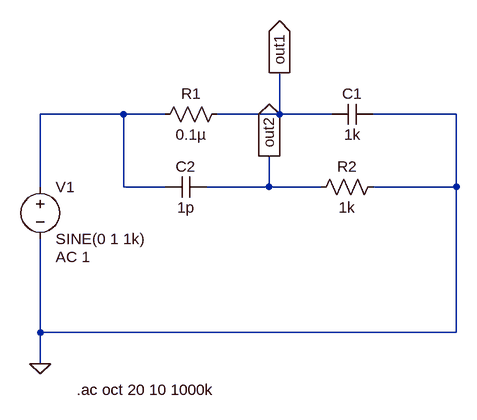
[diagram p0: schematic c-analysis.asc]
c-analysis.asc, the LTspice schematic file:
Version 4.1
SHEET 1 880 680
WIRE -224 80 -352 80
WIRE -160 80 -224 80
WIRE 16 80 16 16
WIRE 16 80 -80 80
WIRE 96 80 16 80
WIRE 288 80 160 80
WIRE -352 192 -352 80
WIRE -224 192 -224 80
WIRE -160 192 -224 192
WIRE 0 192 0 144
WIRE 0 192 -96 192
WIRE 80 192 0 192
WIRE 288 192 288 80
WIRE 288 192 160 192
WIRE -352 416 -352 272
WIRE 288 416 288 192
WIRE 288 416 -352 416
WIRE -352 464 -352 416
FLAG -352 464 0
FLAG 16 16 out1
IOPIN 16 16 Out
FLAG 0 144 out2
IOPIN 0 144 Out
SYMBOL voltage -352 176 R0
WINDOW 123 24 124 Left 2
WINDOW 39 0 0 Left 0
SYMATTR InstName V1
SYMATTR Value SINE(0 1 1k)
SYMATTR Value2 AC 1
SYMBOL res -64 64 R90
WINDOW 0 0 56 VBottom 2
WINDOW 3 32 56 VTop 2
SYMATTR InstName R1
SYMATTR Value 0.1µ
SYMBOL cap 160 64 R90
WINDOW 0 0 32 VBottom 2
WINDOW 3 32 32 VTop 2
SYMATTR InstName C1
SYMATTR Value 1k
SYMBOL cap -96 176 R90
WINDOW 0 0 32 VBottom 2
WINDOW 3 32 32 VTop 2
SYMATTR InstName C2
SYMATTR Value 1p
SYMBOL res 176 176 R90
WINDOW 0 0 56 VBottom 2
WINDOW 3 32 56 VTop 2
SYMATTR InstName R2
SYMATTR Value 1k
TEXT -296 504 Left 2 !.ac oct 20 10 1000k

The netlist it stands for:
* c-analysis.asc
V1 N001 0 SINE(0 1 1k) AC 1
R1 out1 N001 0.1µ
C1 0 out1 1k
C2 out2 N001 1p
R2 0 out2 1k
.ac oct 20 10 1000k
.backanno
.end